# Altium schematic sheet Debugging.SchDoc
size A4
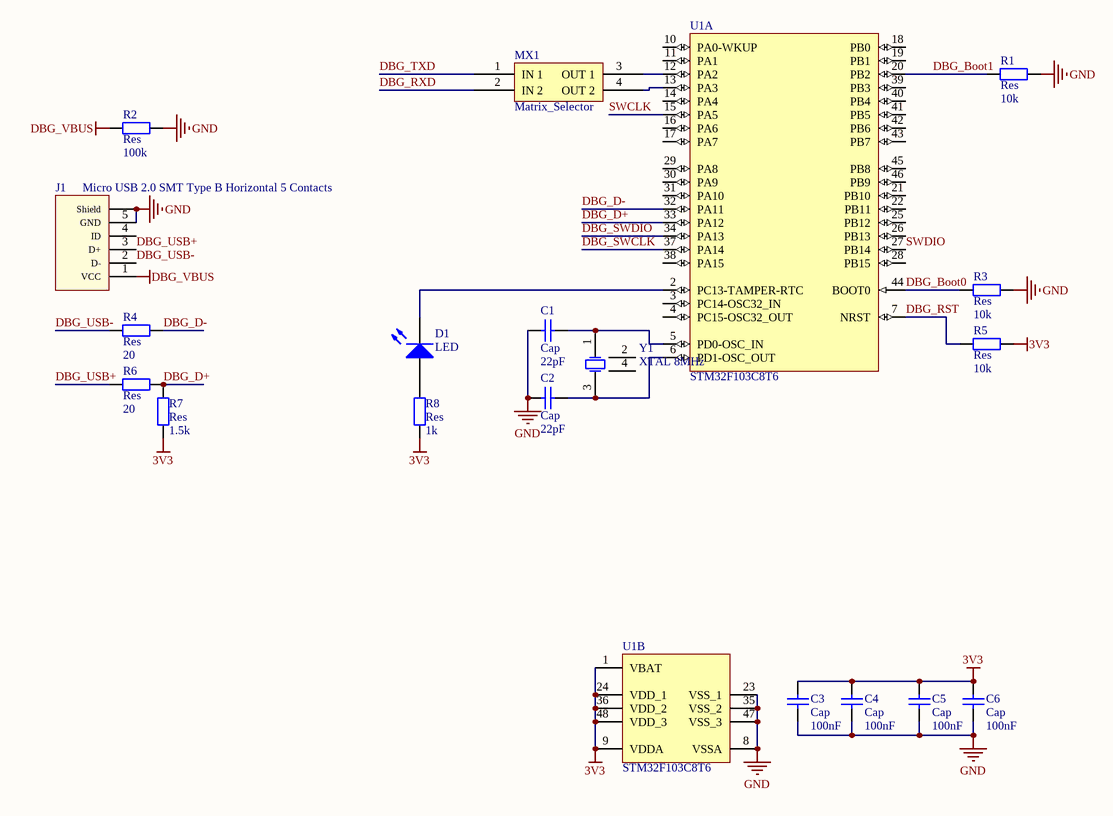
[diagram p0: Debugging.SchDoc]

## Parts
C1  Cap  value 22pF  [C0603]
C2  Cap  value 22pF  [C0603]
C3  Cap  value 100nF  [C0603]
C4  Cap  value 100nF  [C0603]
C5  Cap  value 100nF  [C0603]
C6  Cap  value 100nF  [C0603]
D1  LED  [0805_Led]
J1  Micro USB 2.0 SMT Type B Horizontal 5 Contacts  [629105136821]
MX1  Matrix_Selector  [Matrix_Selector]
R1  Res  value 10k  [R0805]
R2  Res  value 100k  [R0805]
R3  Res  value 10k  [R0805]
R4  Res  value 20  [R0805]
R5  Res  value 10k  [R0805]
R6  Res  value 20  [R0805]
R7  Res  value 1.5k  [R0805]
R8  Res  value 1k  [R0805]
U1  STM32F103C8T6  [STM-LQFP48_N]  (parts A,B of 2)
Y1  XTAL 8MHz  [SMD-3225_4P]

## Nets
3V3: C3.2 C4.2 C5.2 C6.2 R5.2 R7.1 R8.1 U1.1(VBAT) U1.9(VDDA) U1.24(VDD_1) U1.36(VDD_2) U1.48(VDD_3)
DBG_VBUS: J1.1(VCC) R2.2
GND: C1.1 C2.1 C3.1 C4.1 C5.1 C6.1 J1.5(GND) J1.Shell(Shield) R1.2 R2.1 R3.2 U1.8(VSSA) U1.23(VSS_1) U1.35(VSS_2) U1.47(VSS_3)
DBG_Boot0: R3.1 U1.44(BOOT0)
DBG_Boot1: R1.1 U1.20(PB2)
DBG_D+: R6.2 R7.2 U1.33(PA12)
DBG_D-: R4.2 U1.32(PA11)
DBG_RST: R5.1 U1.7(NRST)
DBG_RXD: MX1.2(IN_2)
DBG_SWCLK: U1.37(PA14)
DBG_SWDIO: U1.34(PA13)
DBG_TXD: MX1.1(IN_1)
DBG_USB+: J1.3(D+) R6.1
DBG_USB-: J1.2(D-) R4.1
SWCLK: U1.15(PA5)
SWDIO: U1.27(PB14)
NetC1_2: C1.2 U1.5(PD0-OSC_IN) Y1.1(OSC1)
NetC2_2: C2.2 U1.6(PD1-OSC_OUT) Y1.3(OSC2)
NetD1_1: D1.1(K) U1.2(PC13-TAMPER-RTC)
NetD1_2: D1.2(A) R8.2
NetMX1_3: MX1.3(OUT_1) U1.12(PA2)
NetMX1_4: MX1.4(OUT_2) U1.13(PA3)

Not connected (* = marked no-connect by the designer): J1 4(ID); U1 3(PC14-OSC32_IN) 4(PC15-OSC32_OUT) 10(PA0-WKUP) 11(PA1) 14(PA4) 16(PA6) 17(PA7) 18(PB0) 19(PB1) 21(PB10) 22(PB11) 25(PB12) 26(PB13) 28(PB15) 29(PA8) 30(PA9) 31(PA10) 38(PA15) 39(PB3) 40(PB4) 41(PB5) 42(PB6) 43(PB7) 45(PB8) 46(PB9); Y1 2(OSC1) 4(OSC1)

## Library data of the parts
C1-C6 = Cap: Capacitor; Published: 8-Jun-2000; LatestRevisionDate: 17-Jul-2002; LatestRevisionNote: Re-released for DXP Platform.; PackageReference: RAD-0.3; Publisher: Altium Limited; PackageDescription: Radial Cap, Thru-Hole; 2 Leads; 0.3 in Pin Spacing
D1 = LED: SMD LED; PCB_Layout: Complies with manufacturer's recommendation.; Published: 14-Mar-2008; DatasheetVersion: Mar-2007; PackageVersion: Mar-2007; PackageReference: LWP4SG; Publisher: Altium Limited; PackageDescription: White LED; 2 Reverse Gullwing Leads, Body 1.9 x 0.875mm (Dia.xH); ComponentLink1Description: Manufacturer Link; ComponentLink1URL: http://www.osram-os.com/; ComponentLink2Description: Datasheet; ComponentLink2URL: http://catalog.osram-os.com/catalogue/catalogue.do;jsessionid=AD571800CED0208623E7FAFDF556DB1C?act=downloadFile&favOid=020000030001e106000200b6
J1 = Micro USB 2.0 SMT Type B Horizontal 5 Contacts: Micro USB 2.0 SMT Type B Horizontal 5 Contacts WR-COM; Interface Type: Type B; Gender: Receptacle; ComponentLink1Description: Manufacturer; ComponentLink1URL: http://www.we-online.de; ComponentLink2Description: Datasheet; ComponentLink2URL: http://katalog.we-online.de/em/datasheet/629105136821.pdf; Part Number: 629105136821; Published Date: April 2017; Publisher: Wurth Elektronik; Sub-Family: Micro USB 2.0; Type: Horizontal; Construction: SMT
R1-R8 = Res: Resistor; Published: 8-Jun-2000; LatestRevisionDate: 17-Jul-2002; LatestRevisionNote: Re-released for DXP Platform.; PackageReference: AXIAL-0.4; Publisher: Altium Limited; PackageDescription: Axial Device, Thru-Hole; 2 Leads; 0.4 in Pin Spacing
U1 = STM32F103C8T6: ARM Cortex-M3 32-bit MCU, 64 KB Flash, 20 KB Internal RAM, 37 I/Os, 48-pin LQFP, -40 to 85 degC, Tray; A/D Converter: 2x12-bit (10 Channel); FLASH Size (Prog) (kB): 64; I/Os (High Current): 37; Internal RAM Size (kB): 20; Operating Frequency(F) (Processor speed) (MHz): 72; Supply Voltage(Vcc) min (V): 2; DatasheetVersion: Rev. 16; PackageVersion: Rev. 6, 06/2013; PackageReference: LQFP48; PackageDescription: 48-Pin Low Profile Quad Flat Package, 7 x 7 mm Body, 0.5 mm Pitch; Supplier 1: Digi-Key; Supplier Part Number 1: 497-6063-ND; Supplier 2: Farnell; Supplier Part Number 2: 1447637; Supplier 3: Newark; Supplier Part Number 3: 59M2182; Supplier 4: Newark; Supplier Part Number 4: 57P1222; Supplier 5: Mouser; Supplier Part Number 5: 511-STM32F103C8T6; Core: ARM Cortex-M3; Packing: Tray; Mounting Technology: Surface Mount; PartNumber: STM32F103C8T6; ComponentLink1Description: Manufacturer URL; ComponentLink1URL: http://www.st.com/web/en/home.html; ComponentLink2Description: Datasheet; ComponentLink2URL: http://www.st.com/st-web-ui/static/active/en/resource/technical/document/datasheet/CD00161566.pdf; ComponentLink3Description: Package Specification; ComponentLink3URL: http://www.st.com/st-web-ui/static/active/en/resource/technical/document/datasheet/DM00058181.pdf
Y1 = XTAL_SMD: Crystal; Published: 8-Jun-2000; LatestRevisionDate: 17-Jul-2002; LatestRevisionNote: Re-released for DXP Platform.; PackageReference: R38; Publisher: Altium Limited; PackageDescription: Crystal, Thru-Hole; 2 Leads; Body 3.1 x 8.2 mm (Dia.xH)